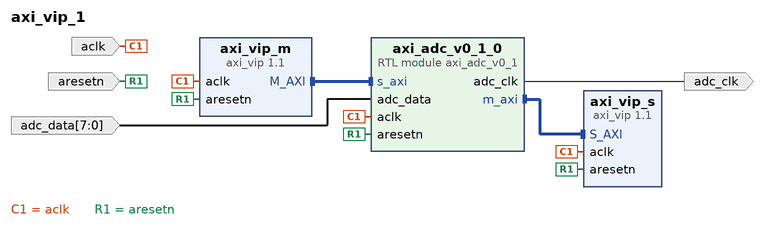
[diagram p0: block diagram of the top level]
# Vivado block design axi_vip_1, xc7z020clg400-2, Vivado 2019.1
create_bd_design axi_vip_1

create_bd_port -dir I aclk
create_bd_port -dir I aresetn
create_bd_port -dir O -type clk adc_clk
create_bd_port -dir I -from 7 -to 0 adc_data

create_bd_cell -type ip -vlnv xilinx.com:ip:axi_vip:1.1 axi_vip_m
set_property -dict [list \
  CONFIG.ADDR_WIDTH 32 \
  CONFIG.DATA_WIDTH 32 \
  CONFIG.HAS_BRESP 1 \
  CONFIG.HAS_PROT 1 \
  CONFIG.HAS_RRESP 1 \
  CONFIG.HAS_WSTRB 1 \
  CONFIG.INTERFACE_MODE MASTER \
  CONFIG.PROTOCOL AXI4LITE \
  CONFIG.READ_WRITE_MODE READ_WRITE \
] [get_bd_cells axi_vip_m]
create_bd_cell -type ip -vlnv xilinx.com:ip:axi_vip:1.1 axi_vip_s
set_property -dict {CONFIG.INTERFACE_MODE SLAVE} [get_bd_cells axi_vip_s]
create_bd_cell -type module -reference axi_adc_v0_1 axi_adc_v0_1_0

# ---- connections ----

connect_bd_intf_net [get_bd_intf_pins axi_vip_m/M_AXI] [get_bd_intf_pins axi_adc_v0_1_0/s_axi]
connect_bd_intf_net [get_bd_intf_pins axi_adc_v0_1_0/m_axi] [get_bd_intf_pins axi_vip_s/S_AXI]
connect_bd_net [get_bd_ports aclk] [get_bd_pins axi_vip_s/aclk] [get_bd_pins axi_vip_m/aclk] [get_bd_pins axi_adc_v0_1_0/aclk]
connect_bd_net [get_bd_ports aresetn] [get_bd_pins axi_vip_m/aresetn] [get_bd_pins axi_vip_s/aresetn] [get_bd_pins axi_adc_v0_1_0/aresetn]
connect_bd_net [get_bd_pins axi_adc_v0_1_0/adc_clk] [get_bd_ports adc_clk]
connect_bd_net [get_bd_ports adc_data] [get_bd_pins axi_adc_v0_1_0/adc_data]

# ---- address map ----
assign_bd_address -offset 0x20000000 -range 64K -target_address_space [get_bd_addr_spaces axi_adc_v0_1_0/m_axi] [get_bd_addr_segs axi_vip_s/S_AXI/Reg]
assign_bd_address -offset 0x40000000 -range 64K -target_address_space [get_bd_addr_spaces axi_vip_m/Master_AXI] [get_bd_addr_segs axi_adc_v0_1_0/s_axi/reg0]

validate_bd_design
save_bd_design
